# EAGLE design AnalogIn_Teensy_V05 (EAGLE 7.7.0)
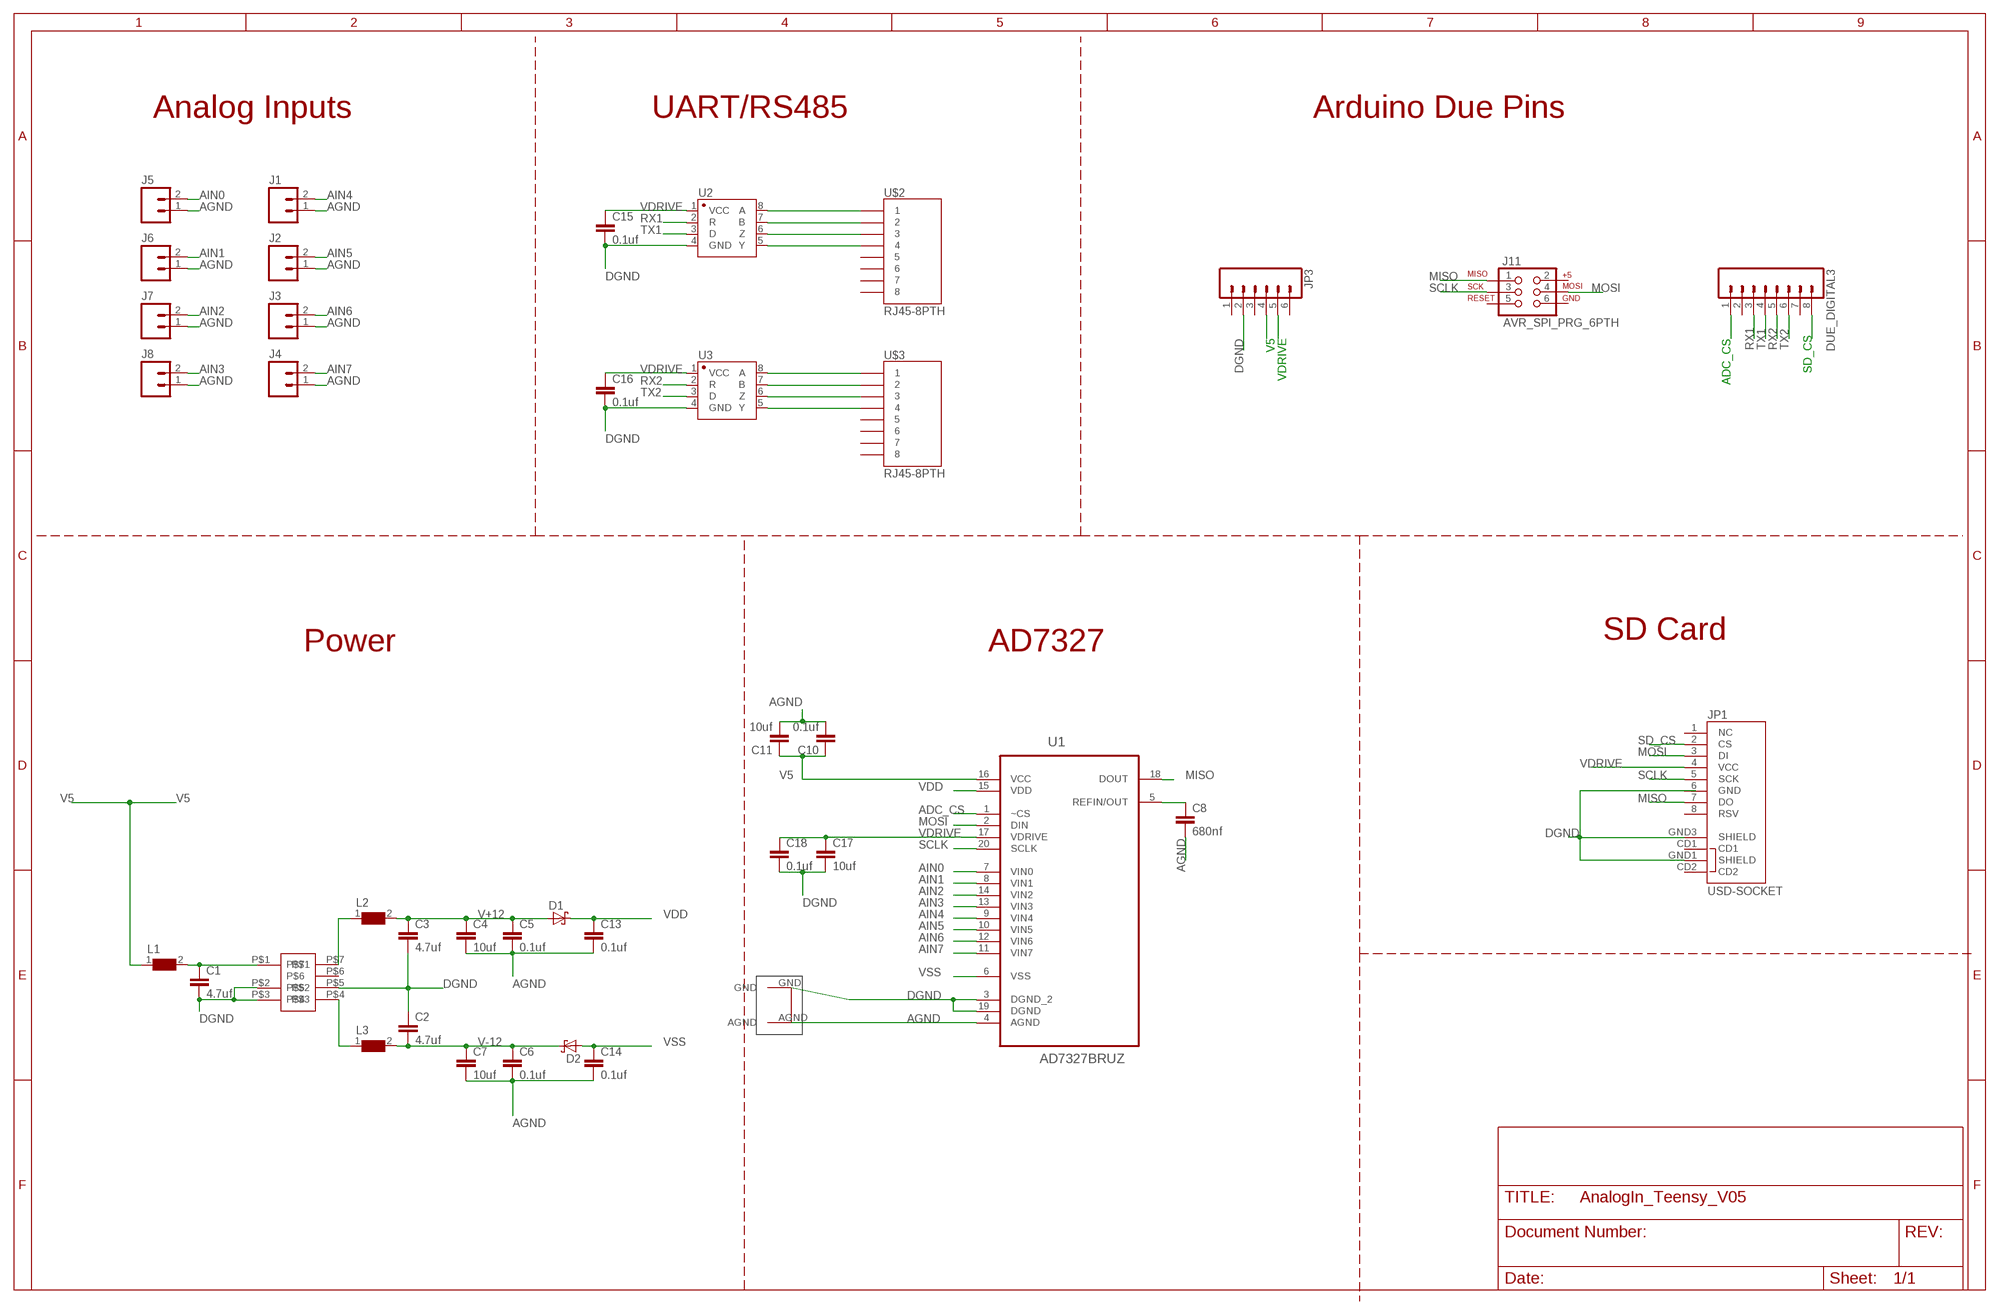
[diagram p0: schematic, sheet 1]

## Parts
C1  4.7uf  CAP1206  [1206]
C2  4.7uf  CAP1206  [1206]
C3  4.7uf  CAP1206  [1206]
C4  10uf  CAP1206  [1206]
C5  0.1uf  CAP1206  [1206]
C6  0.1uf  CAP1206  [1206]
C7  10uf  CAP1206  [1206]
C8  680nf  CAP1206  [1206]
C10  0.1uf  CAP0603-CAP  [0603-CAP]
C11  10uf  CAP0603-CAP  [0603-CAP]
C13  0.1uf  CAP1206  [1206]
C14  0.1uf  CAP1206  [1206]
C15  0.1uf  CAP0603-CAP  [0603-CAP]
C16  0.1uf  CAP0603-CAP  [0603-CAP]
C17  10uf  CAP0603-CAP  [0603-CAP]
C18  0.1uf  CAP0603-CAP  [0603-CAP]
D1  SCHOTTKY-DIODESMD  [SMB]
D2  SCHOTTKY-DIODESMD  [SMB]
DUE_DIGITAL3  M081X08  [1X08]
J1  M023.5MM  [SCREWTERMINAL-3.5MM-2]
J2  M023.5MM  [SCREWTERMINAL-3.5MM-2]
J3  M023.5MM  [SCREWTERMINAL-3.5MM-2]
J4  M023.5MM  [SCREWTERMINAL-3.5MM-2]
J5  M023.5MM  [SCREWTERMINAL-3.5MM-2]
J6  M023.5MM  [SCREWTERMINAL-3.5MM-2]
J7  M023.5MM  [SCREWTERMINAL-3.5MM-2]
J8  M023.5MM  [SCREWTERMINAL-3.5MM-2]
J11  AVR_SPI_PRG_6PTH  [2X3]
JP1  USD-SOCKET  [MICROSD_1:1]
JP3  M06SILK_FEMALE_PTH  [1X06]
L1  WE-CBF-742792118_1206  [1206]
L2  WE-CBF-742792118_1206  [1206]
L3  WE-CBF-742792118_1206  [1206]
U1  AD7327BRUZ  [SOP65P640X120-20N]
U2  SN65HVD31DR  [SO08]
U3  SN65HVD31DR  [SO08]
U$1  TDK_LAMBDA_5_TO_BI_12_125MA  [TDK_LAMBDA_5_TO_BI_12_125MA]
U$2  RJ45-8PTH  [RJ45-8]
U$3  RJ45-8PTH  [RJ45-8]
U$4  GNDPLANESHRT  [GNDPLANESHRT]

## Nets
ADC_CS: DUE_DIGITAL3.1 U1.1(~CS)
AGND: C4.2 C5.2 C6.2 C7.2 C8.2 C10.2 C11.2 C13.2 C14.2 J1.1 J2.1 J3.1 J4.1 J5.1 J6.1 J7.1 J8.1 U1.4(AGND) U$4.AGND
AIN0: J5.2 U1.7(VIN0)
AIN1: J6.2 U1.8(VIN1)
AIN2: J7.2 U1.14(VIN2)
AIN3: J8.2 U1.13(VIN3)
AIN4: J1.2 U1.9(VIN4)
AIN5: J2.2 U1.10(VIN5)
AIN6: J3.2 U1.12(VIN6)
AIN7: J4.2 U1.11(VIN7)
DGND: C1.2 C2.1 C3.2 C15.2 C16.2 C17.2 C18.2 JP1.GND1(SHIELD) JP1.GND3(SHIELD) JP3.2 U1.3(DGND_2) U1.19(DGND) U2.4(GND) U3.4(GND) U$1.P$2 U$1.P$3 U$1.P$5 U$4.GND
MISO: J11.1 JP1.7(DO) U1.18(DOUT)
MOSI: J11.4 JP1.3(DI) U1.2(DIN)
N$1: U2.6(Z) U$2.3
N$3: U2.8(A) U$2.1
N$4: U2.5(Y) U$2.4
N$5: U2.7(B) U$2.2
N$6: U3.6(Z) U$3.3
N$7: U3.5(Y) U$3.4
N$8: U3.8(A) U$3.1
N$9: U3.7(B) U$3.2
N$12: C1.1 L1.2 U$1.P$1
N$13: L2.1 U$1.P$7
N$14: L3.1 U$1.P$4
REF: C8.1 U1.5(REFIN/OUT)
RX1: DUE_DIGITAL3.3 U2.2(R)
RX2: DUE_DIGITAL3.5 U3.2(R)
SCLK: J11.3 JP1.5(SCK) U1.20(SCLK)
SD_CS: DUE_DIGITAL3.8 JP1.2(CS)
TX1: DUE_DIGITAL3.4 U2.3(D)
TX2: DUE_DIGITAL3.6 U3.3(D)
V5: C10.1 C11.1 JP3.4 L1.1 U1.16(VCC)
V+12: C3.1 C4.1 C5.1 D1.A L2.2
V-12: C2.2 C6.1 C7.1 D2.C L3.2
VDD: C13.1 D1.C U1.15(VDD)
VDRIVE: C15.1 C16.1 C17.1 C18.1 JP1.4(VCC) JP3.5 U1.17(VDRIVE) U2.1(VCC) U3.1(VCC)
VSS: C14.1 D2.A U1.6(VSS)
Unconnected: DUE_DIGITAL3.2 DUE_DIGITAL3.7 J11.2 J11.5 J11.6 JP1.1(NC) JP1.6(GND) JP1.8(RSV) JP1.CD1 JP1.CD2 JP3.1 JP3.3 JP3.6 U$1.P$6 U$2.5 U$2.6 U$2.7 U$2.8 U$3.5 U$3.6 U$3.7 U$3.8

## Notes on the sheet
- Analog Inputs | UART/RS485 | Arduino Due Pins
- V5 | VDRIVE
- SD_CS
- ADC_CS
- SD Card
- Power | AD7327

## Library data of the parts
C1-C8 C10 C11 C13-C18 = SparkFun-Capacitors:CAP: Capacitor Standard 0603 ceramic capacitor, and 0.1" leaded capacitor.
D1 D2 = diode:SCHOTTKY-DIODE: Schottky Diode
DUE_DIGITAL3 = SparkFun:M08: Header 8 Standard 8-pin 0.1" header. Use with straight break away headers (SKU : PRT-00116), right angle break away headers (PRT-00553), swiss pins (PRT-00743), machine pins (PRT-00117), and female headers (PRT-00115).
J1-J8 = SparkFun-Connectors:M02: Standard 2-pin 0.1" header. Use with - straight break away headers ( PRT-00116) - right angle break away headers (PRT-00553) - swiss pins (PRT-00743) - machine pins (PRT-00117) - female headers (PRT-00115) Molex polarized connector foot print use with: PRT-08233 with associated crimp pins and housings. 2.54_SCREWTERM for use with PRT-10571. 3.5mm Screw Terminal footprints for PRT-08084 5mm Screw Terminal footprints for use with PRT-08432; PROD_ID: CONN-08399
J11 = SparkFun:AVR_SPI_PRG_6: AVR ISP 6 Pin This is the reduced ISP connector for AVR programming. Common on Arduino. This footprint will take up less PCB space and can be used with a 10-pin to 6-pin adapter such as SKU: BOB-08508
JP1 = SparkFun-Connectors:USD-SOCKET: microSD Socket Push-push type uSD socket. Schematic element and footprint production proven. Spark Fun Electronics SKU : PRT-00127. tDoc lines correctly indicate media card edge positions when inserting (unlocked, locked, depressed). NOTE: CD1 and CD2 are connected internally; PROD_ID: CONN-07820
JP3 = SparkFun-Connectors:M06: Header 6 Standard 6-pin 0.1" header. Use with straight break away headers (SKU : PRT-00116), right angle break away headers (PRT-00553), swiss pins (PRT-00743), machine pins (PRT-00117), and female headers (PRT-00115). Molex polarized connector foot print use with SKU : PRT-08094 with associated crimp pins and housings. NOTES ON THE VARIANTS LOCK and LOCK_LONGPADS... This footprint was designed to help hold the alignment of a through-hole component (i.e. 6-pin header) while soldering it into place. You may notice that each hole has been shifted either up or down by 0.005 of an inch from it's more standard position (which is a perfectly straight line). This slight alteration caused the pins (the squares in the middle) to touch the edges of the holes. Because they are alternating, it causes a "brace" to hold the component in place. 0.005 has proven to be the perfect amount of "off-center" position when using our standard breakaway headers. Although looks a little odd when you look at the bare footprint, once you have a header in there, the alteration is very hard to notice. Also,if you push a header all the way into place, it is covered up entirely on the bottom side. This idea of altering the position of holes to aid alignment will be further integrated into the Sparkfun Library for other footprints. It can help hold any component with 3 or more connection pins.; PROD_ID: CONN-08437
L1-L3 = WE-CBF:WE-CBF: SMD EMI Suppression Ferrite Beads WE-CBF - Excellent anti-EMI properties - Low DC-restistance - Impedances till 3000 ohms - Rated current up to 6 A -- Reliable Ni-Sn electrodes -- Perfect as data lined filter and for uncoupling of distribution voltage; MPN: 742792118; OC_FARNELL: 1800374; OC_NEWARK: 78R5648; PACKAGE: IND-1206; SUPPLIER: Wuerth Elektronik
U1 = AD7327BRUZ:AD7327BRUZ: 500 kSPS, 8-Channel, Software-Selectable, True Bipolar Input, 12-Bit Plus Sign ADC; MPN: AD7327BRUZ; OC_FARNELL: 1274245; OC_NEWARK: 19M0860; PACKAGE: TSSOP-20; SUPPLIER: Analog devices
U2 U3 = Joshparts4:SN65HVD31DR: A placeholder for generic narrow & wide SOIC8 foorptints - used on the DIP adapter board.
U$1 = JoshParts:TDK_LAMBDA_5_TO_BI_12_125MA
U$2 U$3 = SparkFun:RJ45-8: RJ45 Jack Simple RJ45, 8-pin connection - connector for common Cat5, Cat5e, and Cat6 Ethernet cables. Footprint not yet proven in production. Connector sku is PRT-00643; Breakout PCB sku is BOB-00716.
U$4 = Joshparts2:GNDPLANESHRT

## Board
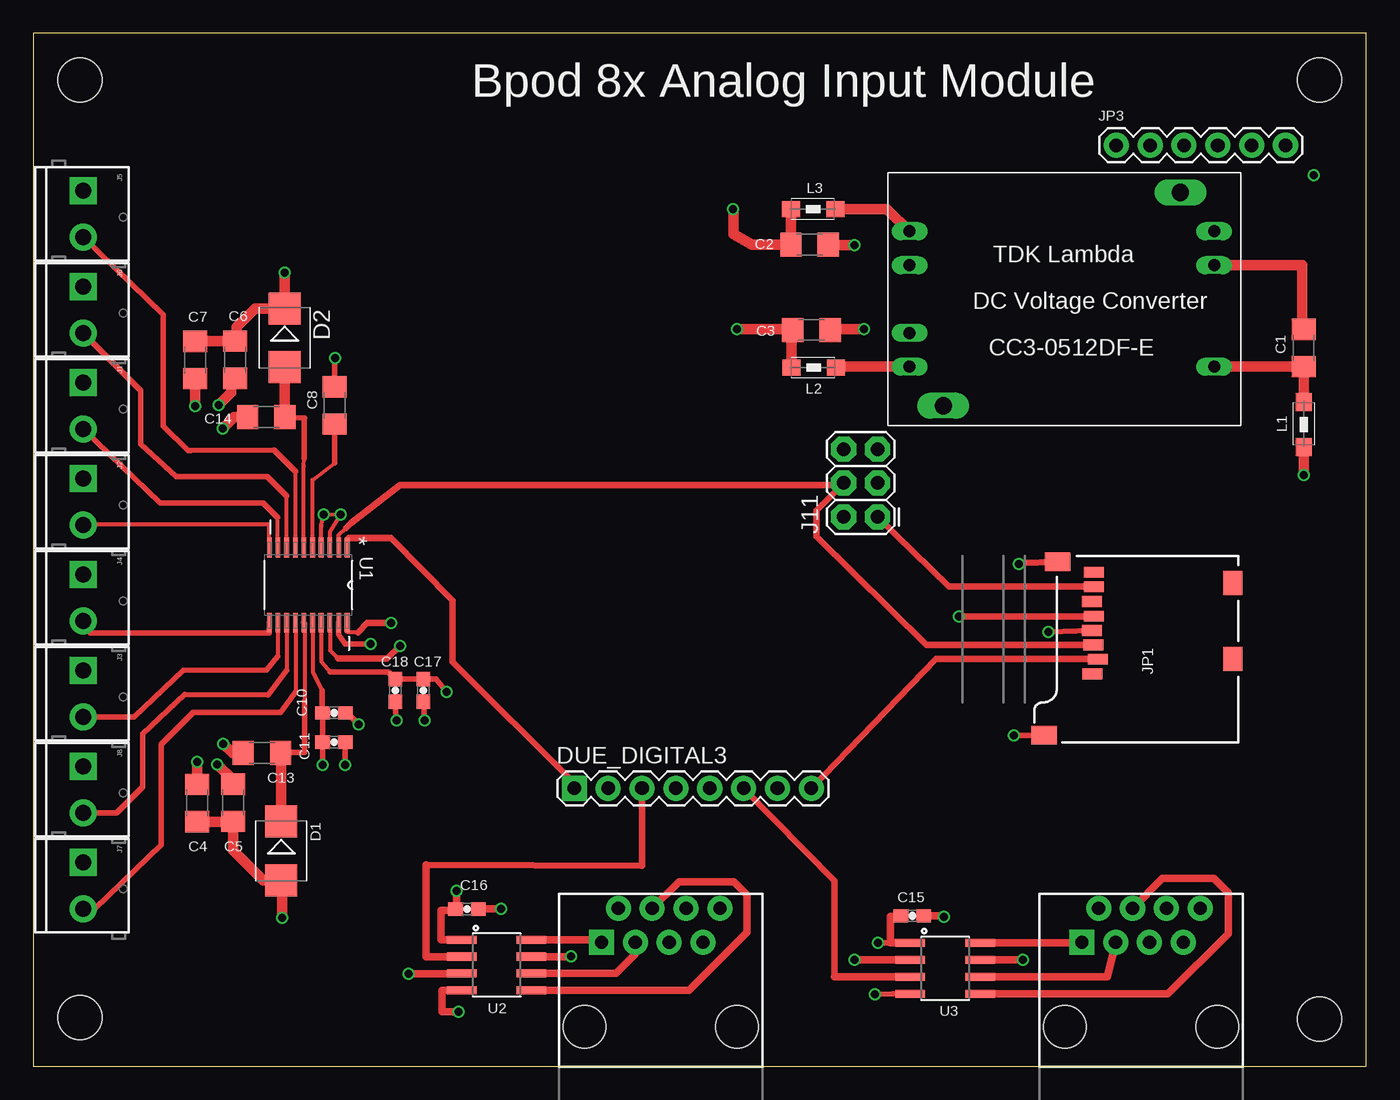
[diagram p1: board, top side]
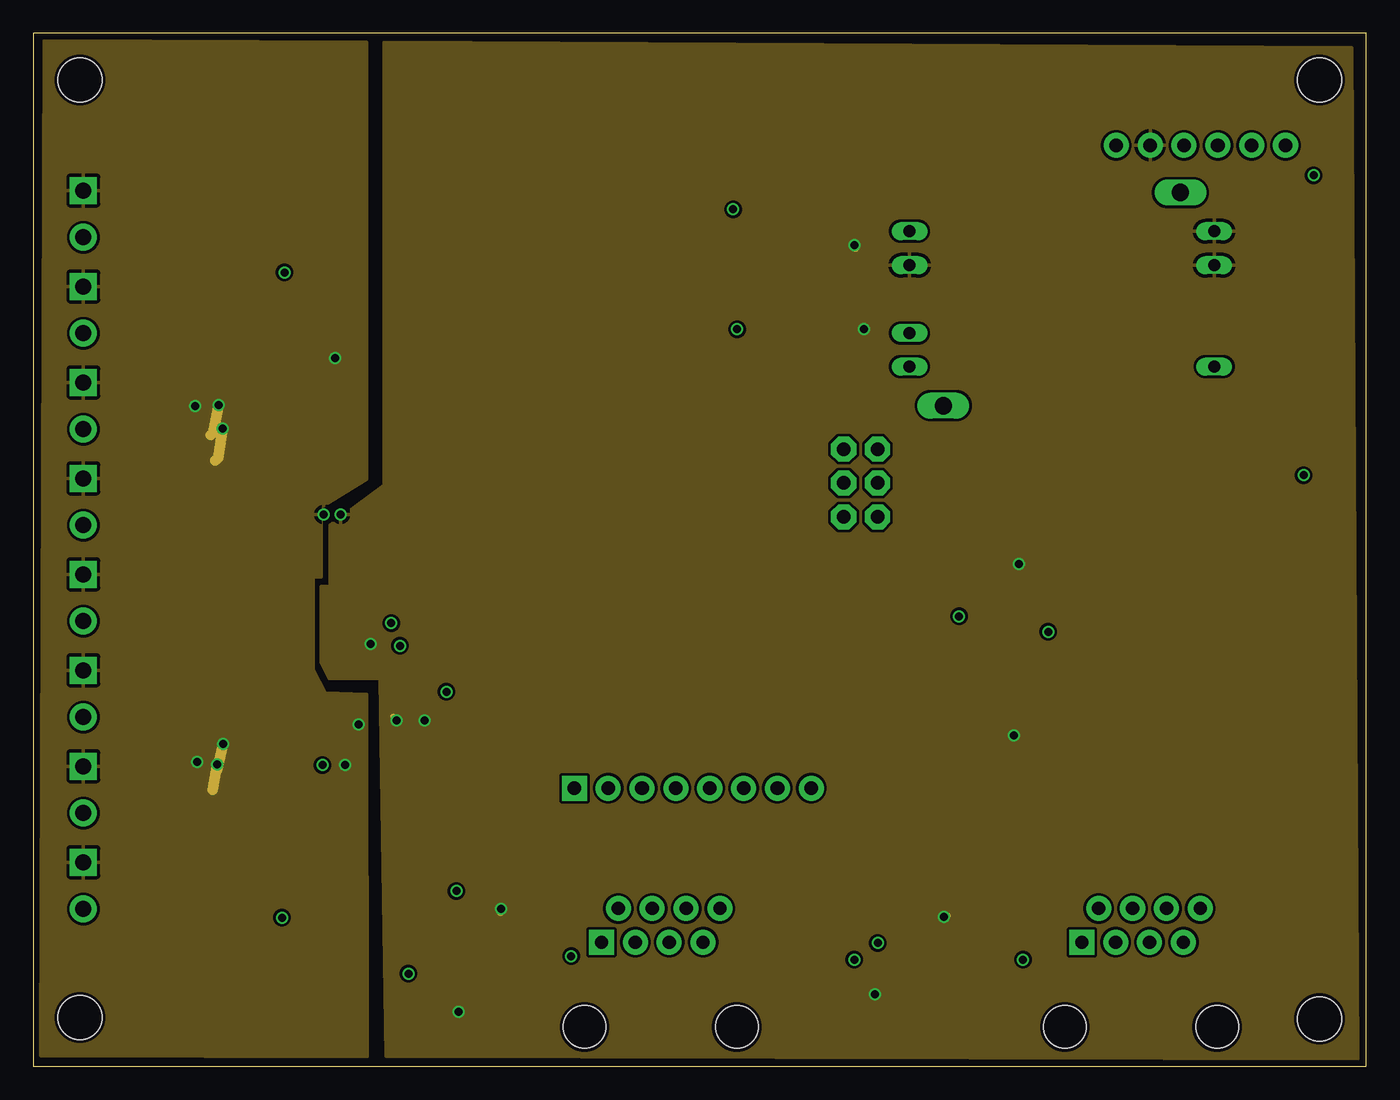
[diagram p2: board, inner layer Route2]
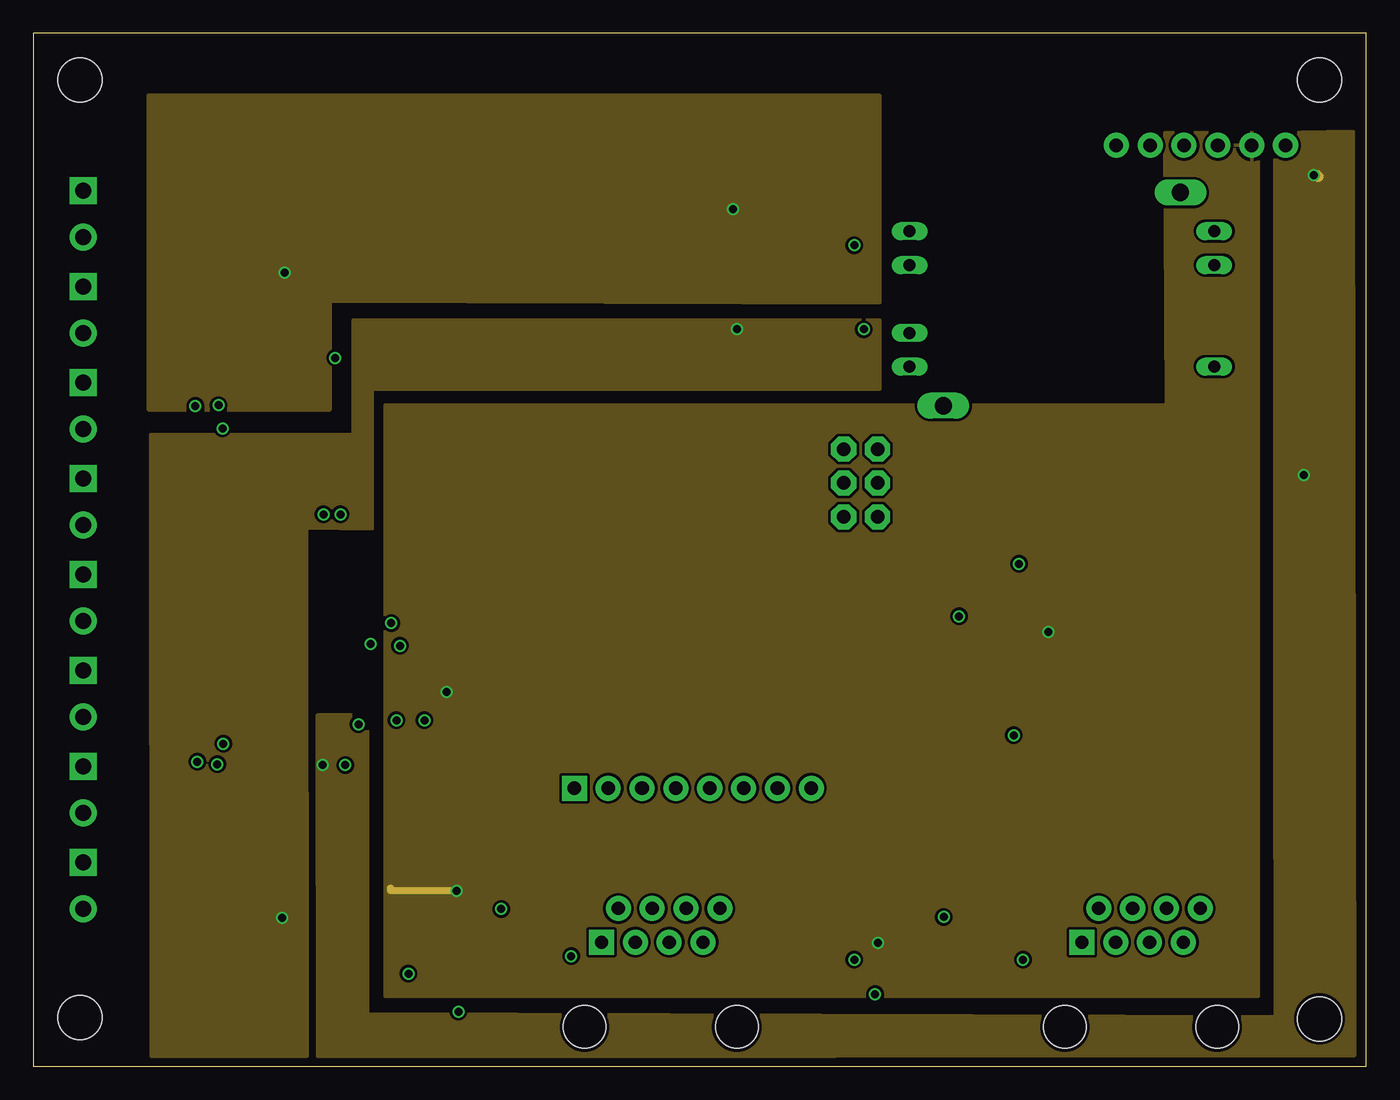
[diagram p3: board, inner layer Route15]
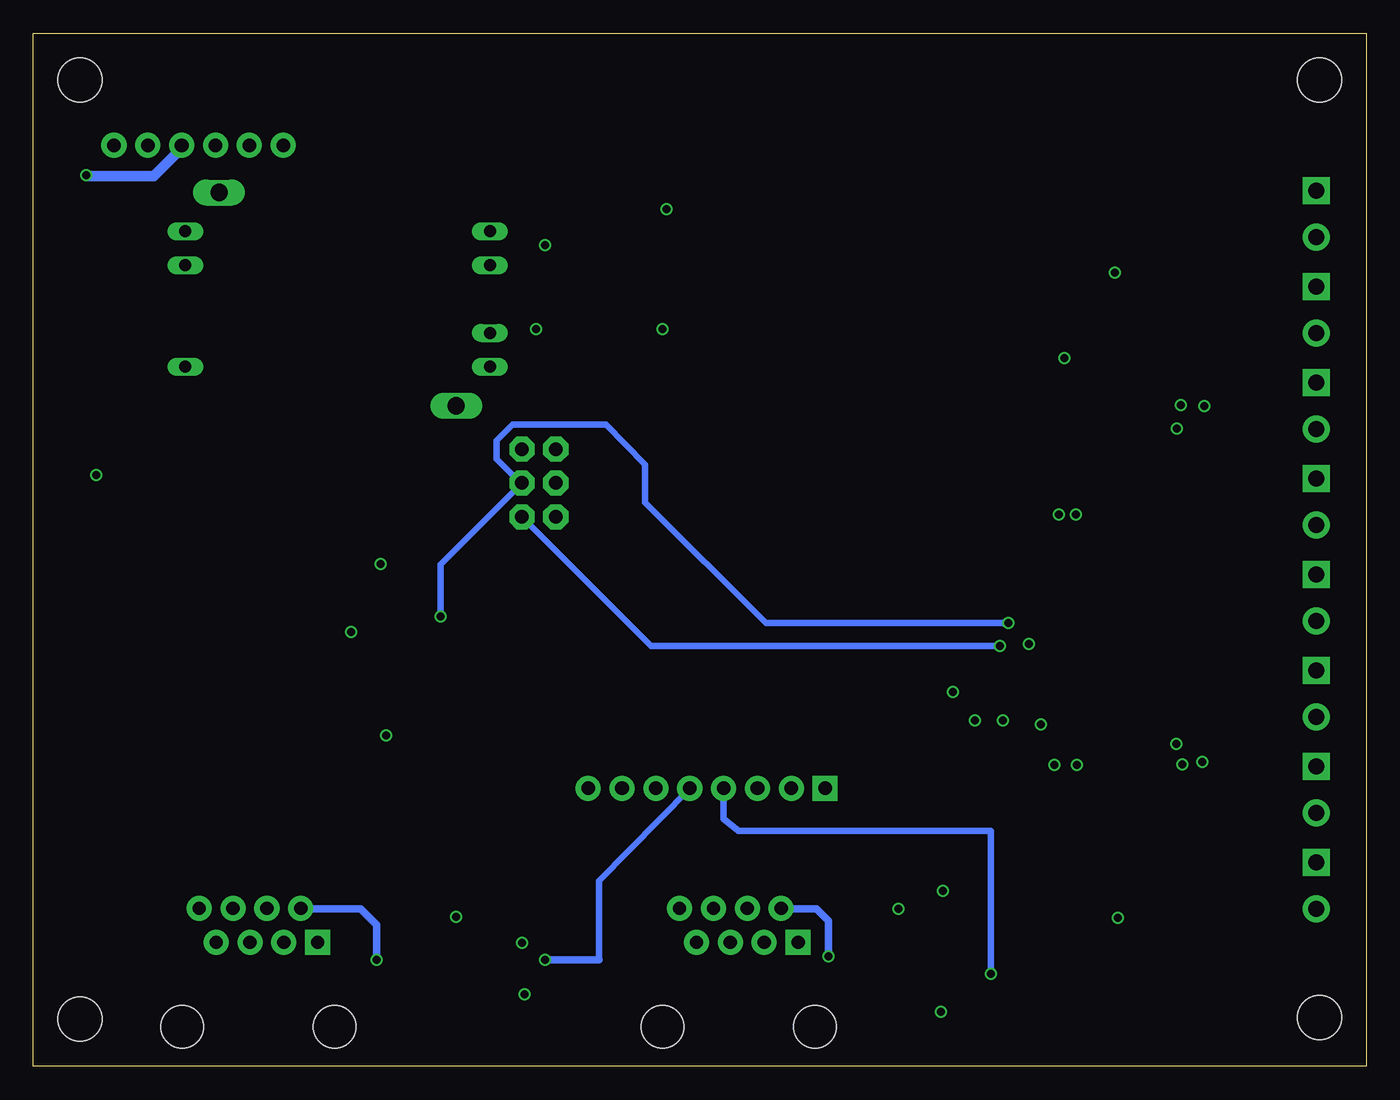
[diagram p4: board, bottom side, seen from below]

Size 100 x 77.5 mm. Coordinates in mm from the lower left corner, seen from the top.
Outline: 0,0 0,77.5 100,77.5 100,0 0,0
Outline: 0,0 0,0
Copper layers (1*2*15*16): Top 0.035mm / dielectric 0.2mm / Route2 0.0175mm / dielectric 0.3mm / Route15 0.0175mm / dielectric 0.2mm / Bottom 0.035mm
Design rules "SeeedStudio_4layer_DRU_20140221": minimum track width 8mil, minimum drill 12mil, track to track 8mil, track to pad 8mil, pad to pad 8mil, via to via 8mil, smd to smd 0mil, copper to edge 10mil, drill to drill 8mil, minimum pad ring 6mil, minimum via ring 4mil, stop-mask expansion 4mil, vias tented up to drill 25mil, thermal gap 10mil

### Footprints (pad centres in the part's own frame; a part is rotated, then mirrored left to right if it is on the bottom)
1206 = smd 1.6 x 1.8: 1 -1.4,0; 2 1.4,0
0603-CAP = smd 1.1 x 1: 1 -0.85,0; 2 0.85,0
SMB = smd 2.4 x 2.4: A 2.2,0; C -2.2,0
1X08 = drill 1.016 pad 1.88 square: 1 0,0 | drill 1.016 pad 1.88: 2 2.54,0; 3 5.08,0; 4 7.62,0; 5 10.16,0; 6 12.7,0; 7 15.24,0; 8 17.78,0
SCREWTERMINAL-3.5MM-2 = drill 1.2 pad 2.032 square: 1 0,0 | drill 1.2 pad 2.032: 2 3.5,0
2X3 = drill 1.016 pad 1.88 octagon: 1 0,0; 2 0,2.54; 3 2.54,0; 4 2.54,2.54; 5 5.08,0; 6 5.08,2.54
MICROSD_1:1 = smd 0.8 x 1.5: 1 5.096,10.919; 2 6.218,10.519; 3 7.274,10.853; 4 8.367,10.982; 5 9.421,10.828; 6 10.539,10.973; 7 11.648,10.819; 8 12.721,10.819 | smd 1.8 x 1.4: CD1 11.92,0.4; CD2 6.22,0.4 | smd 1.4 x 1.9: GND1 0.497,14.55; GND3 13.52,13.55
1X06 = drill 1.016 pad 1.88: 1 0,0; 2 2.54,0; 3 5.08,0; 4 7.62,0; 5 10.16,0; 6 12.7,0
1206' = smd 1.35 x 1.2: 1 -1.675,0; 2 1.675,0
SOP65P640X120-20N = smd 1.473 x 0.356: 1 -2.819,2.921; 2 -2.819,2.286; 3 -2.819,1.626; 4 -2.819,0.965; 5 -2.819,0.33; 6 -2.819,-0.33; 7 -2.819,-0.965; 8 -2.819,-1.626; 9 -2.819,-2.286; 10 -2.819,-2.921; 11 2.819,-2.921; 12 2.819,-2.286; 13 2.819,-1.626; 14 2.819,-0.965; 15 2.819,-0.33; 16 2.819,0.33; 17 2.819,0.965; 18 2.819,1.626; 19 2.819,2.286; 20 2.819,2.921
SO08 = smd 0.61 x 2.21: 1 -1.905,-2.616; 2 -0.635,-2.616; 3 0.635,-2.616; 4 1.905,-2.616; 5 1.905,2.616; 6 0.635,2.616; 7 -0.635,2.616; 8 -1.905,2.616
TDK_LAMBDA_5_TO_BI_12_125MA = drill 0.9 long: P$1 0,-2.92; P$2 0,-10.54; P$3 0,-13.08; P$4 22.86,-13.08; P$5 22.86,-10.54; P$6 22.86,-5.46; P$7 22.86,-2.92 | drill 1.3 long: P$8 20.32,0; P$9 2.54,-16
RJ45-8 = drill 1 pad 1.88 square: 1 -4.445,6.35 | drill 1 pad 1.88: 2 -3.175,8.89; 3 -1.905,6.35; 4 -0.635,8.89; 5 0.635,6.35; 6 1.905,8.89; 7 3.175,6.35; 8 4.445,8.89 | hole 3.2: -5.715,0; 5.715,0
GNDPLANESHRT = drill 0.6: AGND -1.27,0; GND 0,0
STAND-OFF = hole 3.302: 0,0

### Placement (x,y rotation side)
C1  95.3,53.9 90 top
C2  58.24,61.65 180 top
C3  58.38,55.25 0 top
C4  12.3,19.75 90 top
C5  15,19.77 90 top
C6  15.15,53.01 270 top
C7  12.15,52.99 270 top
C8  22.6,49.58 90 top
C10  22.56,26.51 0 top
C11  22.55,24.31 0 top
C13  17.15,23.5 180 top
C14  17.48,48.7 180 top
C15  65.94,11.28 0 top
C16  32.53,11.79 0 top
C17  29.26,28.19 270 top
C18  27.16,28.2 270 top
D1  18.6,16.16 270 top
D2  18.85,54.65 270 top
DUE_DIGITAL3  40.59,20.85 0 top
J1  3.75,51.3 270 top
J2  3.75,44.1 270 top
J3  3.75,29.7 270 top
J4  3.75,36.9 270 top
J5  3.75,65.7 270 top
J6  3.75,58.5 270 top
J7  3.75,15.3 270 top
J8  3.75,22.5 270 top
J11  63.34,41.22 90 top
JP1  90.39,24.33 90 top
JP3  81.25,69.1 0 top
L1  [1206']  95.32,48.14 90 top
L2  [1206']  58.54,52.42 180 top
L3  [1206']  58.52,64.32 180 top
U1  20.63,36.1 270 top
U2  34.76,7.59 270 top
U3  68.41,7.34 270 top
U$1  88.6,49.56 180 top
U$2  47.07,2.95 0 top
U$3  83.11,2.95 0 top
U$4  23.05,41.4 0 top
U$5  [STAND-OFF]  3.5,3.65 0 top
U$6  [STAND-OFF]  96.5,3.55 0 top
U$7  [STAND-OFF]  3.5,74 0 top
U$8  [STAND-OFF]  96.5,74 0 top

### Tracks (layer width: path | path; a pad name or v marks a point on that pad's centre or on a via)
ADC_CS
  Top 0.3: 23.65,39.65 23.55,39.57 U1.1
  Top 0.5: DUE_DIGITAL3.1 40.59,21.21 31.45,30.35 31.45,34.95 26.85,39.65 23.65,39.65
AGND  (via drill 0.6)
  Top 0.25: U$4.AGND 23.05,41.4
  Top 0.3: U1.4 21.59,40.52 U$4.AGND
  Top 0.305: U1.4
  Top 0.406: 12.35,49.5 v12.15,49.55 | C6.2 15.15,51.55 14.85,51.55 | C13.2 15.75,23.65 | 12.3,22.9 v12.3,22.85 | C5.2 15.03,21.17 15.05,21.15 14.98,21.15 14.95,21.15 14.85,21.05 14.85,21.15 | C11.2 23.41,23.25 v23.4,22.6 | C8.2 22.6,53.1 v22.65,53.15 | C10.2 23.54,26.51 v24.4,25.65
  Top 0.8: C4.2 v12.3,22.85 | C5.2 14.98,21.15 14.98,21.47 v13.8,22.65 | v12.15,49.55 C7.2 | 14.85,51.55 14.85,50.55 v13.9,49.6 | C14.2 15.05,48.7 v14.2,47.85 | C13.2 14.95,23.5 v14.25,24.2
  Route2 0.406: v24.4,25.65 24.4,25.55 24.45,25.5
  Route2 0.8: v13.9,49.6 13.5,47.55 13.3,47.35 | v14.2,47.85 13.85,45.65 13.65,45.45 | v13.8,22.65 13.45,20.75 | v14.25,24.2 13.8,22.25
  pour Route2: 0.8,76.95 25,76.85 25,44.05 21.6,41.95 21.6,36.7 21,36.7 21,29.75 21.9,28 25,27.9 25.05,0.7 0.55,0.8
AIN0
  Top 0.305: U1.7 19.66,44.63
  Top 0.406: 19.66,44.63 18.05,46.25 11.8,46.2 11.6,46.2 9.75,48.05 9.75,56.4 J5.2
AIN1
  Top 0.305: U1.8 19,42.8
  Top 0.406: 19,42.8 17.55,44.25 10.7,44.25 8.05,46.7 8.05,50.7 J6.2
AIN2
  Top 0.305: U1.14 19.66,28.07
  Top 0.406: 19.66,28.07 18.55,26.55 12,26.55 9.6,24.15 9.6,16.6 4.6,11.8 J7.2
AIN3
  Top 0.305: U1.13 19,29.7
  Top 0.406: 19,29.7 17.6,27.85 11.35,27.9 8.2,24.95 8.2,20.95 6.25,19 J8.2
AIN4
  Top 0.305: U1.9 18.34,41.16
  Top 0.406: 18.34,41.16 17.25,42.25 9.5,42.25 J1.2
AIN5
  Top 0.3: U1.10 17.7,40.65 3.75,40.65 J2.2
AIN6
  Top 0.305: U1.12 18.34,30.74
  Top 0.406: 18.34,30.74 17.5,29.75 11.25,29.7 7.55,26.2 J3.2
AIN7
  Top 0.406: U1.11 17.7,32.5 4.25,32.5 J4.2
DGND  (via drill 0.6)
  Top 0.3: U1.3 22.26,40.11 U$4.GND
  Top 0.406: C18.2 27.21,26.11 v27.25,25.95 | C17.2 29.31,26.74 29.35,25.9 v29.35,25.95 | U3.4 64.47,5.43 v63.15,5.4 | v25.3,31.7 23.4,31.7 22.92,32.38 U1.19 | C2.1 59.75,61.59 | C3.2 59.83,55.3 | 74,37.75 v73.95,37.7 | JP1.GND1 v73.55,24.83
  Top 0.5: JP1.GND3 74,37.75
  Top 0.55: C16.2 v35.1,11.79 v35.1,11.8 | U2.4 30.65,5.68 30.65,4.1 v31.9,4.1 | C15.2 68.25,11.28 v68.3,11.2
  Top 0.8: C1.2 95.2,55.3 95.2,60.1 U$1.P$2 | 59.83,55.3 v62.3,55.3 | 59.75,61.59 61.66,61.59 v61.6,61.6
  Route2 0.406: v27.25,25.95 27.2,26.1 27,26.25
  Route2 0.55: v35.1,11.8 35.2,11.75 35.05,11.55 | v68.3,11.2 68.4,11.3 68.55,11.3
  Route2 0.8: v61.6,61.6 61.65,61.5 61.55,61.6
  Bottom 0.55: v31.9,4.1 32,4.1 32,4.15
  pour Route2: 98.9,76.4 99.35,0.55 26.45,0.75 26,29.05 22.2,29.1 21.6,30.3 21.6,36 22.25,36 22.25,40.6 26.3,43.6 26.3,76.85
MISO  (via drill 0.6)
  Top 0.3: U1.18 22.26,31.19 22.85,30.6
  Top 0.5: JP1.7 68.68,35.98 J11.1 | 22.85,30.6 26.55,30.6 v27.5,31.55
  Bottom 0.5: v27.5,31.55 53.67,31.55 J11.1
MOSI
  Top 0.3: U1.2 22.92,39.87 23.45,40.4
  Top 0.5: 79.84,31.5 JP1.3 67,31.6 58.75,39.75 58.75,41.71 J11.4 60.21,43.6 27.5,43.6 23.85,40.75 23.45,40.4
N$1
  Top 0.55: U2.6 43.7,6.96 45.15,8.4 45.15,9.29 U$2.3
N$3
  Top 0.55: U2.8 42.43,9.49 U$2.1
N$4
  Top 0.55: U2.5 49.19,5.68 53.55,10.05 53.55,12.85 52.55,13.85 48.45,13.85 U$2.4
N$5  (via drill 0.6)
  Top 0.55: U2.7 40.33,8.22 v40.35,8.25
  Bottom 0.55: v40.35,8.25 40.35,10.9 41.25,11.8 43.85,11.8 U$2.2
N$6
  Top 0.55: U3.6 80.58,6.71 U$3.3
N$7
  Top 0.55: U3.5 85.14,5.43 89.65,9.95 89.65,13 88.55,14.1 84.7,14.1 U$3.4
N$8
  Top 0.55: U3.8 78.58,9.24 U$3.1
N$9  (via drill 0.6)
  Top 0.55: U3.7 74.22,7.97 v74.25,8
  Bottom 0.55: v74.25,8 74.25,10.6 75.45,11.8 79.86,11.8 U$3.2
N$12
  Top 0.406: 88.98,52.48 U$1.P$1
  Top 0.8: L1.2 95.32,52.5 C1.1 88.6,52.5 U$1.P$1
N$13
  Top 0.8: U$1.P$7 60.27,52.48 L2.1
N$14
  Top 0.8: L3.1 64.06,64.32 U$1.P$4
REF
  Top 0.305: U1.5 20.95,44 22.6,45.25
  Top 0.406: 22.6,45.25 C8.1
RX1
  Top 0.5: 29.45,15.1 45.67,15.05 DUE_DIGITAL3.3
  Top 0.55: U2.2 29.45,8.22 29.45,15.1
RX2  (via drill 0.6)
  Top 0.55: v61.6,8 61.6,7.97 U3.2
  Bottom 0.5: 57.55,8 57.55,13.9 DUE_DIGITAL3.5
  Bottom 0.55: 57.55,8 v61.6,8
SCLK  (via drill 0.6)
  Top 0.3: 24.35,32.55 23.6,32.55 23.55,32.6 U1.20
  Top 0.5: JP1.5 69.55,33.75 v69.45,33.75 | v26.85,33.25 25.05,33.25 24.35,32.55
  Bottom 0.5: v69.45,33.75 69.45,37.65 J11.3 63.46,43.76 65.25,45.55 65.25,46.95 64.05,48.15 57.05,48.15 54.1,45.15 54.1,42.3 45.05,33.25 v26.85,33.25
SD_CS
  Top 0.5: JP1.2 67.72,30.55 DUE_DIGITAL3.8
TX1  (via drill 0.6)
  Top 0.55: v28.15,6.95 U2.3
  Bottom 0.5: DUE_DIGITAL3.4 48.21,18.56 47.1,17.65 28.15,17.65 v28.15,6.95
TX2
  Top 0.5: 60.09,6.71 60.09,13.9 DUE_DIGITAL3.6
  Top 0.55: 60.09,6.71 U3.3
V5  (via drill 0.6)
  Top 0.305: U1.16 20.96,29.56 21,29.5 21.65,28.2
  Top 0.406: C11.1 21.7,26.55 C10.1 21.65,26.95 21.65,28.2 | C11.1 21.7,24.36 | C11.1 v21.7,22.6
  Top 0.8: L1.1 95.3,46.47 v95.3,44.35
  Route15 0.8: v96.05,66.85 96.3,66.85 96.4,66.75
  Bottom 0.8: JP3.4 88.72,69.03 90.95,66.8 96,66.8 v96.05,66.85
  pour Route15: 21.35,26.3 25,26.3 25,3.85 93.25,3.65 93.25,15.7 93.2,15.6 93.2,69.95 98.95,70.1 99.05,0.85 21.4,0.8
V+12  (via drill 0.6)
  Top 0.406: 14.83,18.35 C5.1 | C3.1 56.87,55.73 56.43,55.3
  Top 0.8: 56.43,55.3 v52.8,55.3 | L2.2 56.87,55.13 C3.1 | v18.65,11.15 18.65,13.91 D1.A 17.24,13.96 15,16.2 C5.1 | 14.83,18.35 C4.1
  pour Route15: 63.5,56 24,56 24,47.4 8.8,47.4 8.85,0.75 20.55,0.75 20.5,40.4 25.4,40.3 25.4,50.8 63.5,50.8
V-12  (via drill 0.6)
  Top 0.8: L3.2 C2.2 53.9,61.65 52.52,62.43 52.52,64.32 v52.5,64.3 | v18.85,59.55 D2.C 16.65,56.85 15.25,55.45 15.25,54.51 C6.1 12.17,54.41 C7.1
  pour Route15: 63.45,72.8 8.7,72.8 8.7,49.3 22.2,49.3 22.2,57.5 63.45,57.35
VDD
  Top 0.305: 20.35,33.18 20.35,27.4
  Top 0.406: U1.15 20.35,33.18 | 18.6,23.5 C13.1 18.6,23.55 20.35,23.55 20.35,27.4
  Top 0.8: D1.C 18.6,23.45 C13.1
VDRIVE  (via drill 0.6)
  Top 0.305: U1.17 21.59,30.36 22.25,29.6
  Top 0.406: 22.25,29.6 26.6,29.6 26.95,29.25 27.25,29.14 C18.1 29.12,29.04 C17.1 30.21,29.04 v31,28.1 | v63.35,9.25 64.5,9.26 U3.1 | JP1.4 v76.15,32.6
  Top 0.55: U3.1 64.65,9.25 64.3,9.25 64.3,11.24 C15.1 | U2.1 30.6,9.49 30.6,11.7 31.68,11.7 C16.1 31.75,11.79 v31.75,13.15
  Route15 0.55: v31.75,13.15 26.8,13.2 26.8,13.35
  pour Route15: 91.9,70.05 91.9,5.25 26.4,5.25 26.4,49.6 85,49.6 84.9,70.05
VSS
  Top 0.305: U1.6 20.3,45 20.3,45.6
  Top 0.406: 18.85,51.55 D2.A 18.88,51.62 | C14.1 20.35,48.65 20.3,48.6 20.3,45.6
  Top 0.8: 18.85,51.55 18.85,48.73 C14.1

### Text on the board
tNames: Bpod 8x Analog Input Module